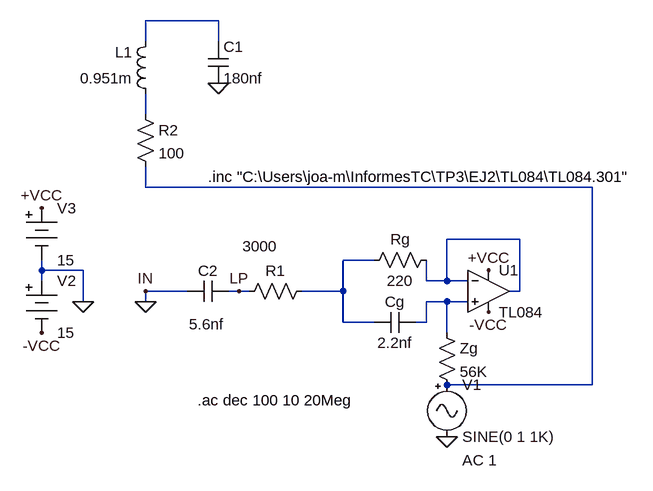
[diagram p0: schematic gyrator_lowpass.asc]
gyrator_lowpass.asc, the LTspice schematic file:
Version 4
SHEET 1 880 680
WIRE -272 -256 -384 -256
WIRE -384 -224 -384 -256
WIRE -272 -224 -272 -256
WIRE -384 -112 -384 -144
WIRE -384 0 -384 -32
WIRE 304 0 -384 0
WIRE 192 80 80 80
WIRE -32 112 -80 112
WIRE -544 128 -544 112
WIRE -480 128 -544 128
WIRE -544 144 -544 128
WIRE 48 144 48 112
WIRE 80 144 80 80
WIRE 80 144 48 144
WIRE 112 144 80 144
WIRE -320 160 -384 160
WIRE -240 160 -256 160
WIRE -224 160 -240 160
WIRE -80 160 -80 112
WIRE -80 160 -144 160
WIRE 192 160 192 80
WIRE 192 160 176 160
WIRE -480 176 -480 128
WIRE -384 176 -384 160
WIRE 80 176 48 176
WIRE 112 176 80 176
WIRE -80 208 -80 160
WIRE -32 208 -80 208
WIRE 48 208 48 176
WIRE 48 208 32 208
WIRE 80 224 80 176
WIRE 304 304 304 0
WIRE 304 304 80 304
FLAG 80 384 0
FLAG -384 176 0
FLAG -544 32 +VCC
FLAG -544 224 -VCC
FLAG -480 176 0
FLAG -384 160 IN
FLAG 144 128 +VCC
FLAG 144 192 -VCC
FLAG -240 160 LP
FLAG -272 -160 0
SYMBOL res 64 96 R90
WINDOW 0 0 56 VBottom 2
WINDOW 3 32 56 VTop 2
SYMATTR InstName Rg
SYMATTR Value 220
SYMBOL res 64 208 R0
SYMATTR InstName Zg
SYMATTR Value 56K
SYMBOL cap 32 192 R90
WINDOW 0 0 32 VBottom 2
WINDOW 3 32 32 VTop 2
SYMATTR InstName Cg
SYMATTR Value 2.2nf
SYMBOL res -128 144 R90
WINDOW 0 0 56 VBottom 2
WINDOW 3 -69 80 VTop 2
SYMATTR InstName R1
SYMATTR Value 3000
SYMBOL cap -256 144 R90
WINDOW 0 0 32 VBottom 2
WINDOW 3 51 34 VTop 2
SYMATTR InstName C2
SYMATTR Value 5.6nf
SYMBOL Misc\\signal 80 288 R0
WINDOW 123 24 132 Left 2
WINDOW 39 0 0 Left 0
SYMATTR Value2 AC 1
SYMATTR InstName V1
SYMBOL Misc\\battery -544 128 R0
WINDOW 123 0 0 Left 0
WINDOW 39 0 0 Left 0
SYMATTR InstName V2
SYMATTR Value 15
SYMBOL Misc\\battery -544 16 R0
WINDOW 123 0 0 Left 0
WINDOW 39 0 0 Left 0
SYMATTR InstName V3
SYMATTR Value 15
SYMBOL Opamps\\opamp2 144 96 R0
SYMATTR InstName U1
SYMATTR Value TL084
SYMATTR SpiceModel TL084
SYMBOL res -400 -128 R0
SYMATTR InstName R2
SYMATTR Value 100
SYMBOL ind -368 -128 R180
WINDOW 0 36 80 Left 2
WINDOW 3 36 40 Left 2
SYMATTR InstName L1
SYMATTR Value 0.951m
SYMBOL cap -288 -224 R0
SYMATTR InstName C1
SYMATTR Value 180nf
TEXT -304 328 Left 2 !.ac dec 100 10 20Meg
TEXT -288 -16 Left 2 !.inc "C:\\Users\\joa-m\\InformesTC\\TP3\\EJ2\\TL084\\TL084.301"

The netlist it stands for:
* gyrator_lowpass.asc
Rg N004 N005 220
R§Zg N006 N003 56K
Cg N006 N005 2.2nf
R1 N005 LP 3000
C2 LP 0 5.6nf
V1 N003 0 SINE(0 1 1K) AC 1
V2 0 -VCC 15
V3 +VCC 0 15
XU1 N006 N004 +VCC -VCC N004 TL084 TL084  ; pins In+ In- V+ V- OUT
R2 N002 N003 100
L1 N002 N001 0.951m
C1 N001 0 180nf
.ac dec 100 10 20Meg
.inc "C:\Users\joa-m\InformesTC\TP3\EJ2\TL084\TL084.301"
.backanno
.end